# Altium project PCB_TCU_Project.PrjPcb
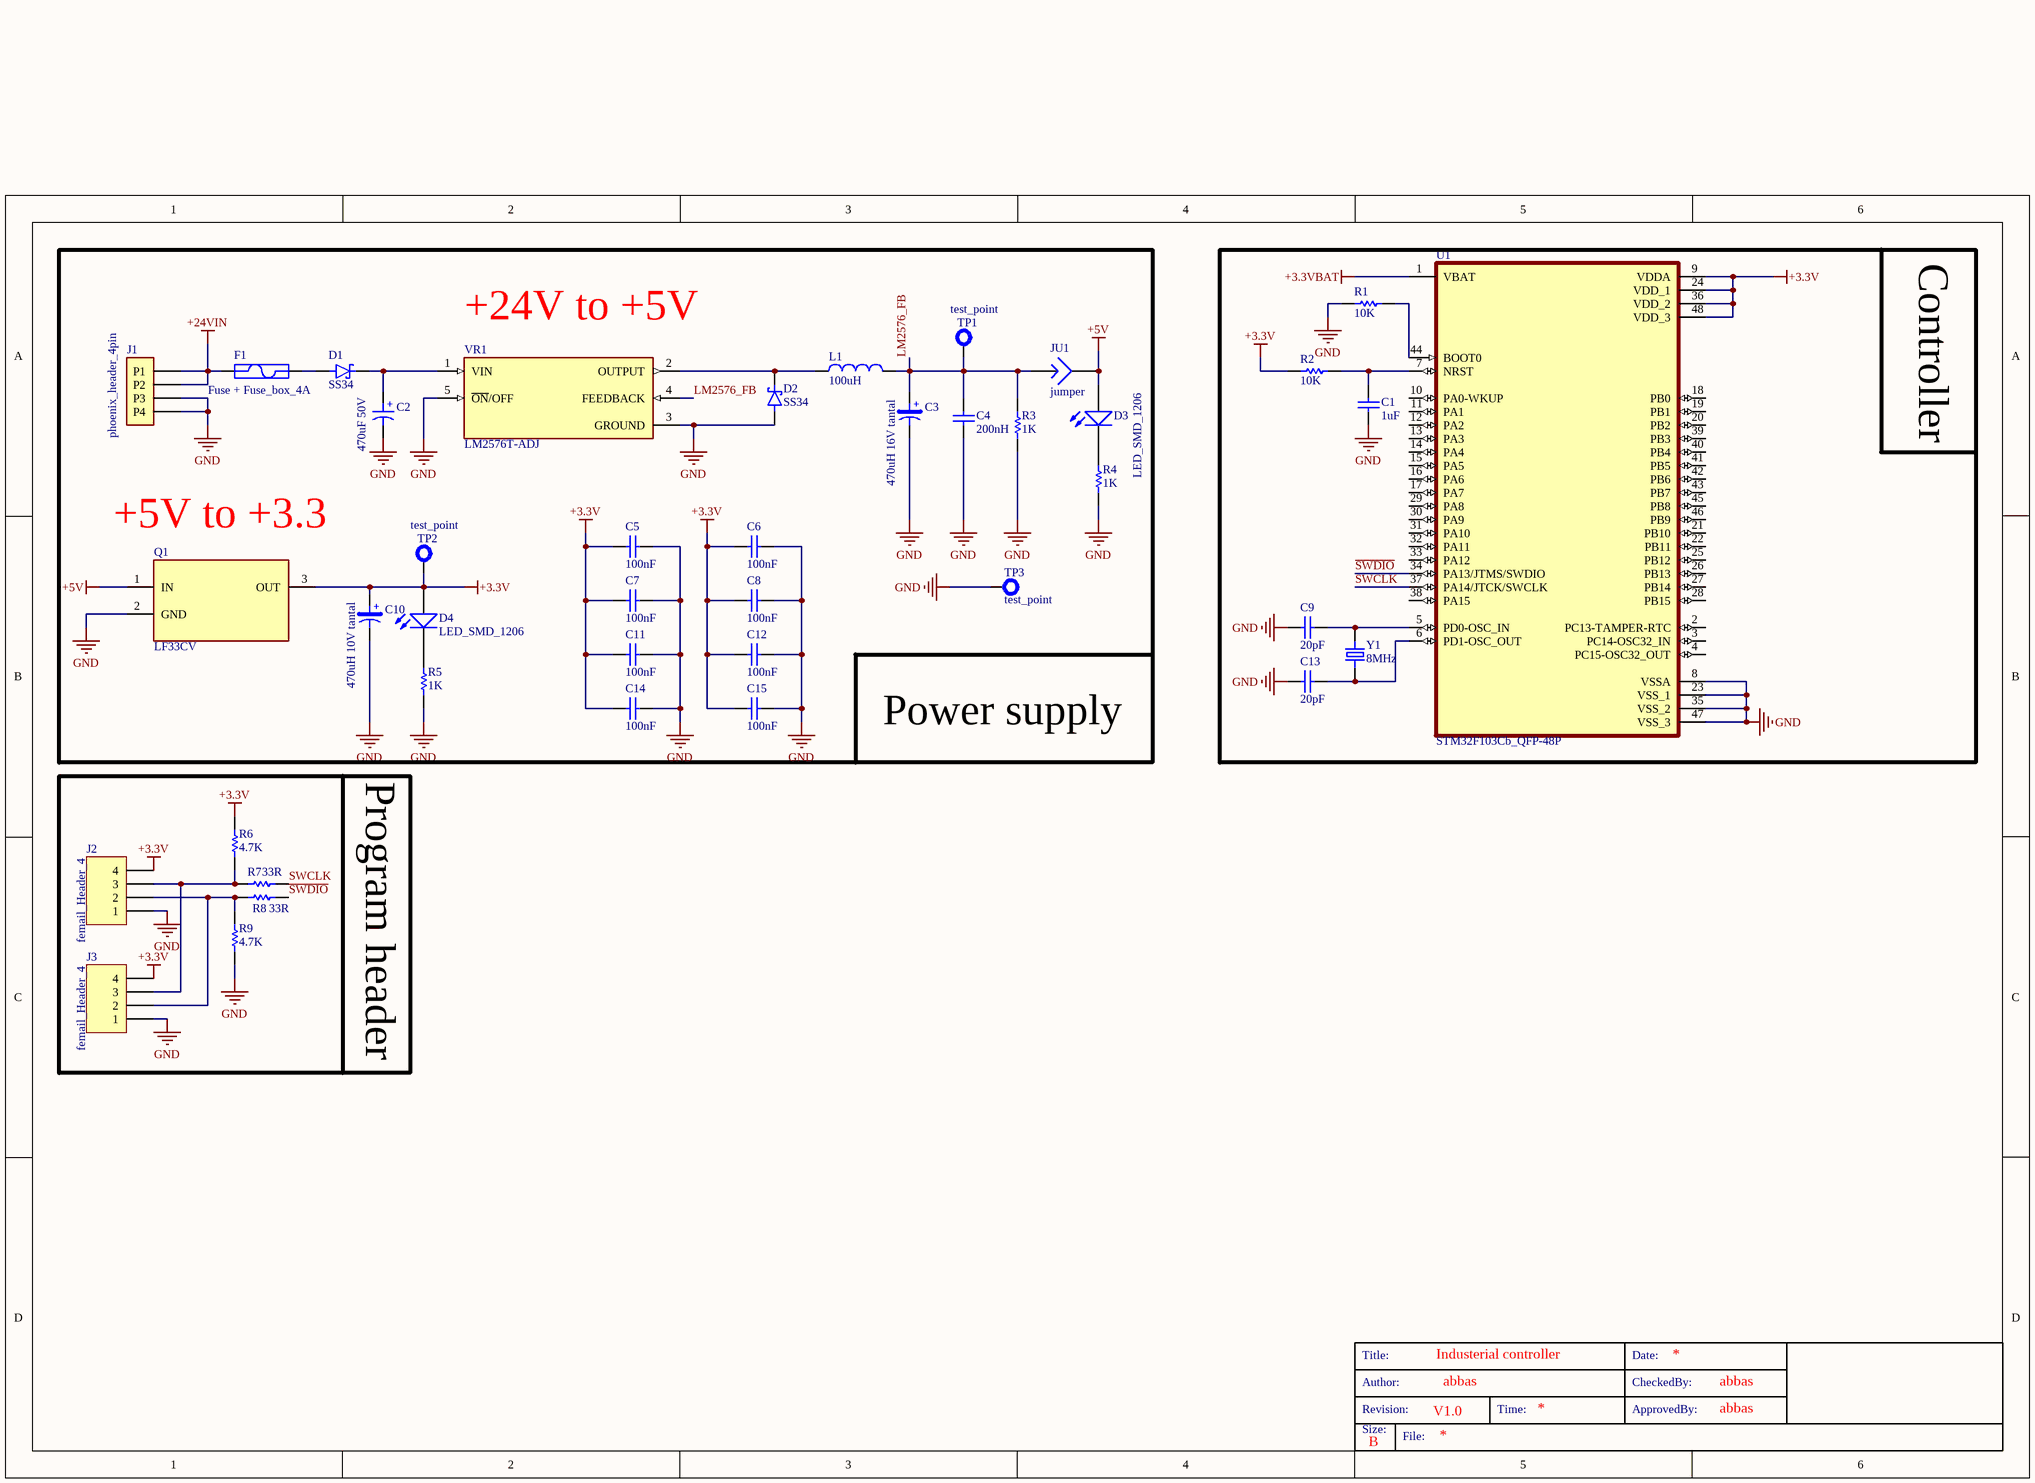
[diagram p0: schematic.SchDoc]
1 sheet, 41 parts. Net scope: global (net labels, ports and power ports of the same name join across sheets).
Board file: pcb.PcbDoc

## Sheet schematic.SchDoc: Industerial controller
size B; ApprovedBy: abbas; CheckedBy: abbas; Author: abbas; Revision: V1.0; SheetNumber: 1; SheetTotal: 1; Size: A4

### Parts
C1  1uF  [cap ceramic 1206]
C2  470uF 50V  [capacity]
C3  470uH 16V tantal  [Tantalium_cap_D size]
C4  200nH  [cap ceramic 1206]
C5  100nF  [cap ceramic 1206]
C6  100nF  [cap ceramic 1206]
C7  100nF  [cap ceramic 1206]
C8  100nF  [cap ceramic 1206]
C9  20pF  [cap ceramic 1206]
C10  470uH 10V tantal  [Tantalium_cap_D size]
C11  100nF  [cap ceramic 1206]
C12  100nF  [cap ceramic 1206]
C13  20pF  [cap ceramic 1206]
C14  100nF  [cap ceramic 1206]
C15  100nF  [cap ceramic 1206]
D1  SS34  [SS34_smd]
D2  SS34  [SS34_smd]
D3  LED_SMD_1206  [LED_SMD_1206]
D4  LED_SMD_1206  [LED_SMD_1206]
F1  Fuse + Fuse_box_4A  [Fuse_box]
J1  phoenix_header_4pin  [phoenix_header_4pin]
J2  femail_Header_4  [femail_Header_4pin]
J3  femail_Header_4  [femail_Header_4pin]
JU1  jumper  [jumper]
L1  100uH  [Indicator_DIP]
Q1  LF33CV  [LF33CV_TO220_3]
R1  10K  [resistor 1206]
R2  10K  [resistor 1206]
R3  1K  [resistor 1206]
R4  1K  [resistor 1206]
R5  1K  [resistor 1206]
R6  4.7K  [resistor 1206]
R7  33R  [resistor 1206]
R8  33R  [resistor 1206]
R9  4.7K  [resistor 1206]
TP1  test_point  [test_point]
TP2  test_point  [test_point]
TP3  test_point  [test_point]
U1  STM32F103Cb_QFP-48P  [STM32F103Cb_QFP-48P]
VR1  LM2576T-ADJ  [LM2576T-ADJ_TO220]
Y1  8MHz  [Crystal_HC-49US]

### Blocks framed on the sheet
Controller: C1 C9 C13 R1 R2 U1 Y1
Program header: J2 J3 R6-R9

### Nets
+3.3V: C5.2 C6.2 C7.2 C8.2 C10.1 C11.2 C12.2 C14.2 C15.2 D4.2(A) J2.4 J3.4 Q1.3(OUT) R2.2 R6.1 TP2.1 U1.9(VDDA) U1.24(VDD_1) U1.36(VDD_2) U1.48(VDD_3)
+3.3VBAT: U1.1(VBAT)
+5V: D3.2(A) JU1.2 Q1.1(IN)
+24VIN: F1.1 J1.P1 J1.P2
GND: C1.2 C2.2 C3.2 C4.1 C5.1 C6.1 C7.1 C8.1 C9.1 C10.2 C11.1 C12.1 C13.1 C14.1 C15.1 D2.A J1.P3 J1.P4 J2.1 J3.1 Q1.2(GND) R1.2 R3.1 R4.1 R5.1 R9.2 TP3.1 U1.8(VSSA) U1.23(VSS_1) U1.35(VSS_2) U1.47(VSS_3) VR1.3(GROUND) VR1.5(~{ON}/OFF)
~{SWDIO}: R8.1 U1.34(PA13/JTMS/SWDIO)
LM2576_FB: C3.1 C4.2 JU1.1 L1.2 R3.2 TP1.1 VR1.4(FEEDBACK)
SWCLK: R7.2 U1.37(PA14/JTCK/SWCLK)
NetC1_1: C1.1 R2.1 U1.7(NRST)
NetC2_1: C2.1 D1.C(K) VR1.1(VIN)
NetC9_2: C9.2 U1.5(PD0-OSC_IN) Y1.1
NetC13_2: C13.2 U1.6(PD1-OSC_OUT) Y1.2
NetD1_A: D1.A F1.2
NetD2_C: D2.C(K) L1.1 VR1.2(OUTPUT)
NetD3_1: D3.1(K) R4.2
NetD4_1: D4.1(K) R5.2
NetJ2_2: J2.2 J3.2 R8.2 R9.1
NetJ2_3: J2.3 J3.3 R6.2 R7.1
NetR1_1: R1.1 U1.44(BOOT0)

Not connected (* = marked no-connect by the designer): U1 2(PC13-TAMPER-RTC) 3(PC14-OSC32_IN) 4(PC15-OSC32_OUT) 10(PA0-WKUP) 11(PA1) 12(PA2) 13(PA3) 14(PA4) 15(PA5) 16(PA6) 17(PA7) 18(PB0) 19(PB1) 20(PB2) 21(PB10) 22(PB11) 25(PB12) 26(PB13) 27(PB14) 28(PB15) 29(PA8) 30(PA9) 31(PA10) 32(PA11) 33(PA12) 38(PA15) 39(PB3) 40(PB4) 41(PB5) 42(PB6) 43(PB7) 45(PB8) 46(PB9)

### Notes on the sheet
- (near VR1) +24V to +5V
- +5V to +3.3
- Power supply
- Title:
- Date:
- Size:
- Author:
- Revision:
- Time:
- CheckedBy:
- ApprovedBy:
- B
- File:
- (in symbol Cap electrolitic radial 6x7-2.5) +
- (in symbol tantalium_cap_D_size) +

### Library data of the parts
C1 C4-C9 C11-C15 = cap ceramic 1206
C2 = Cap electrolitic radial 6x7-2.5
C3 C10 = tantalium_cap_D_size
D1 D2 = SS34: SMD schottky diode
F1 = Fuse_box
J1 = phoenix_header_4pin: Pluggable terminal block; socket; male; 3.5mm; angled 90Â°; ways: 4
J2 J3 = Header_4pin
L1 = Indicator DIP
Q1 = LF33CV: Linear Voltage Regulator IC Positive Fixed 1 Output 500mA TO-220
R1-R9 = Resistor 1206
U1 = STM32F103Cb_QFP-48P: ARMÂ® CortexÂ®-M3 STM32F1 Microcontroller IC 32-Bit Single-Core 72MHz 128KB (128K x 8) FLASH
Y1 = Crystal_HC-49US